# EasyEDA Pro project ProProject_平衡车主板-mpu6050正_2024-04-23.epro

# Schematic SCH原理图
Create Date: 2023-12-14; Page Name: P1; Project Name: 平衡车主板-mpu6050正; Schematic Name: SCH原理图; Update Date: 2023-12-15; Company: 蜗牛学院AIoT; Drawed: lzy; Page Size: A4; Version: V1.2
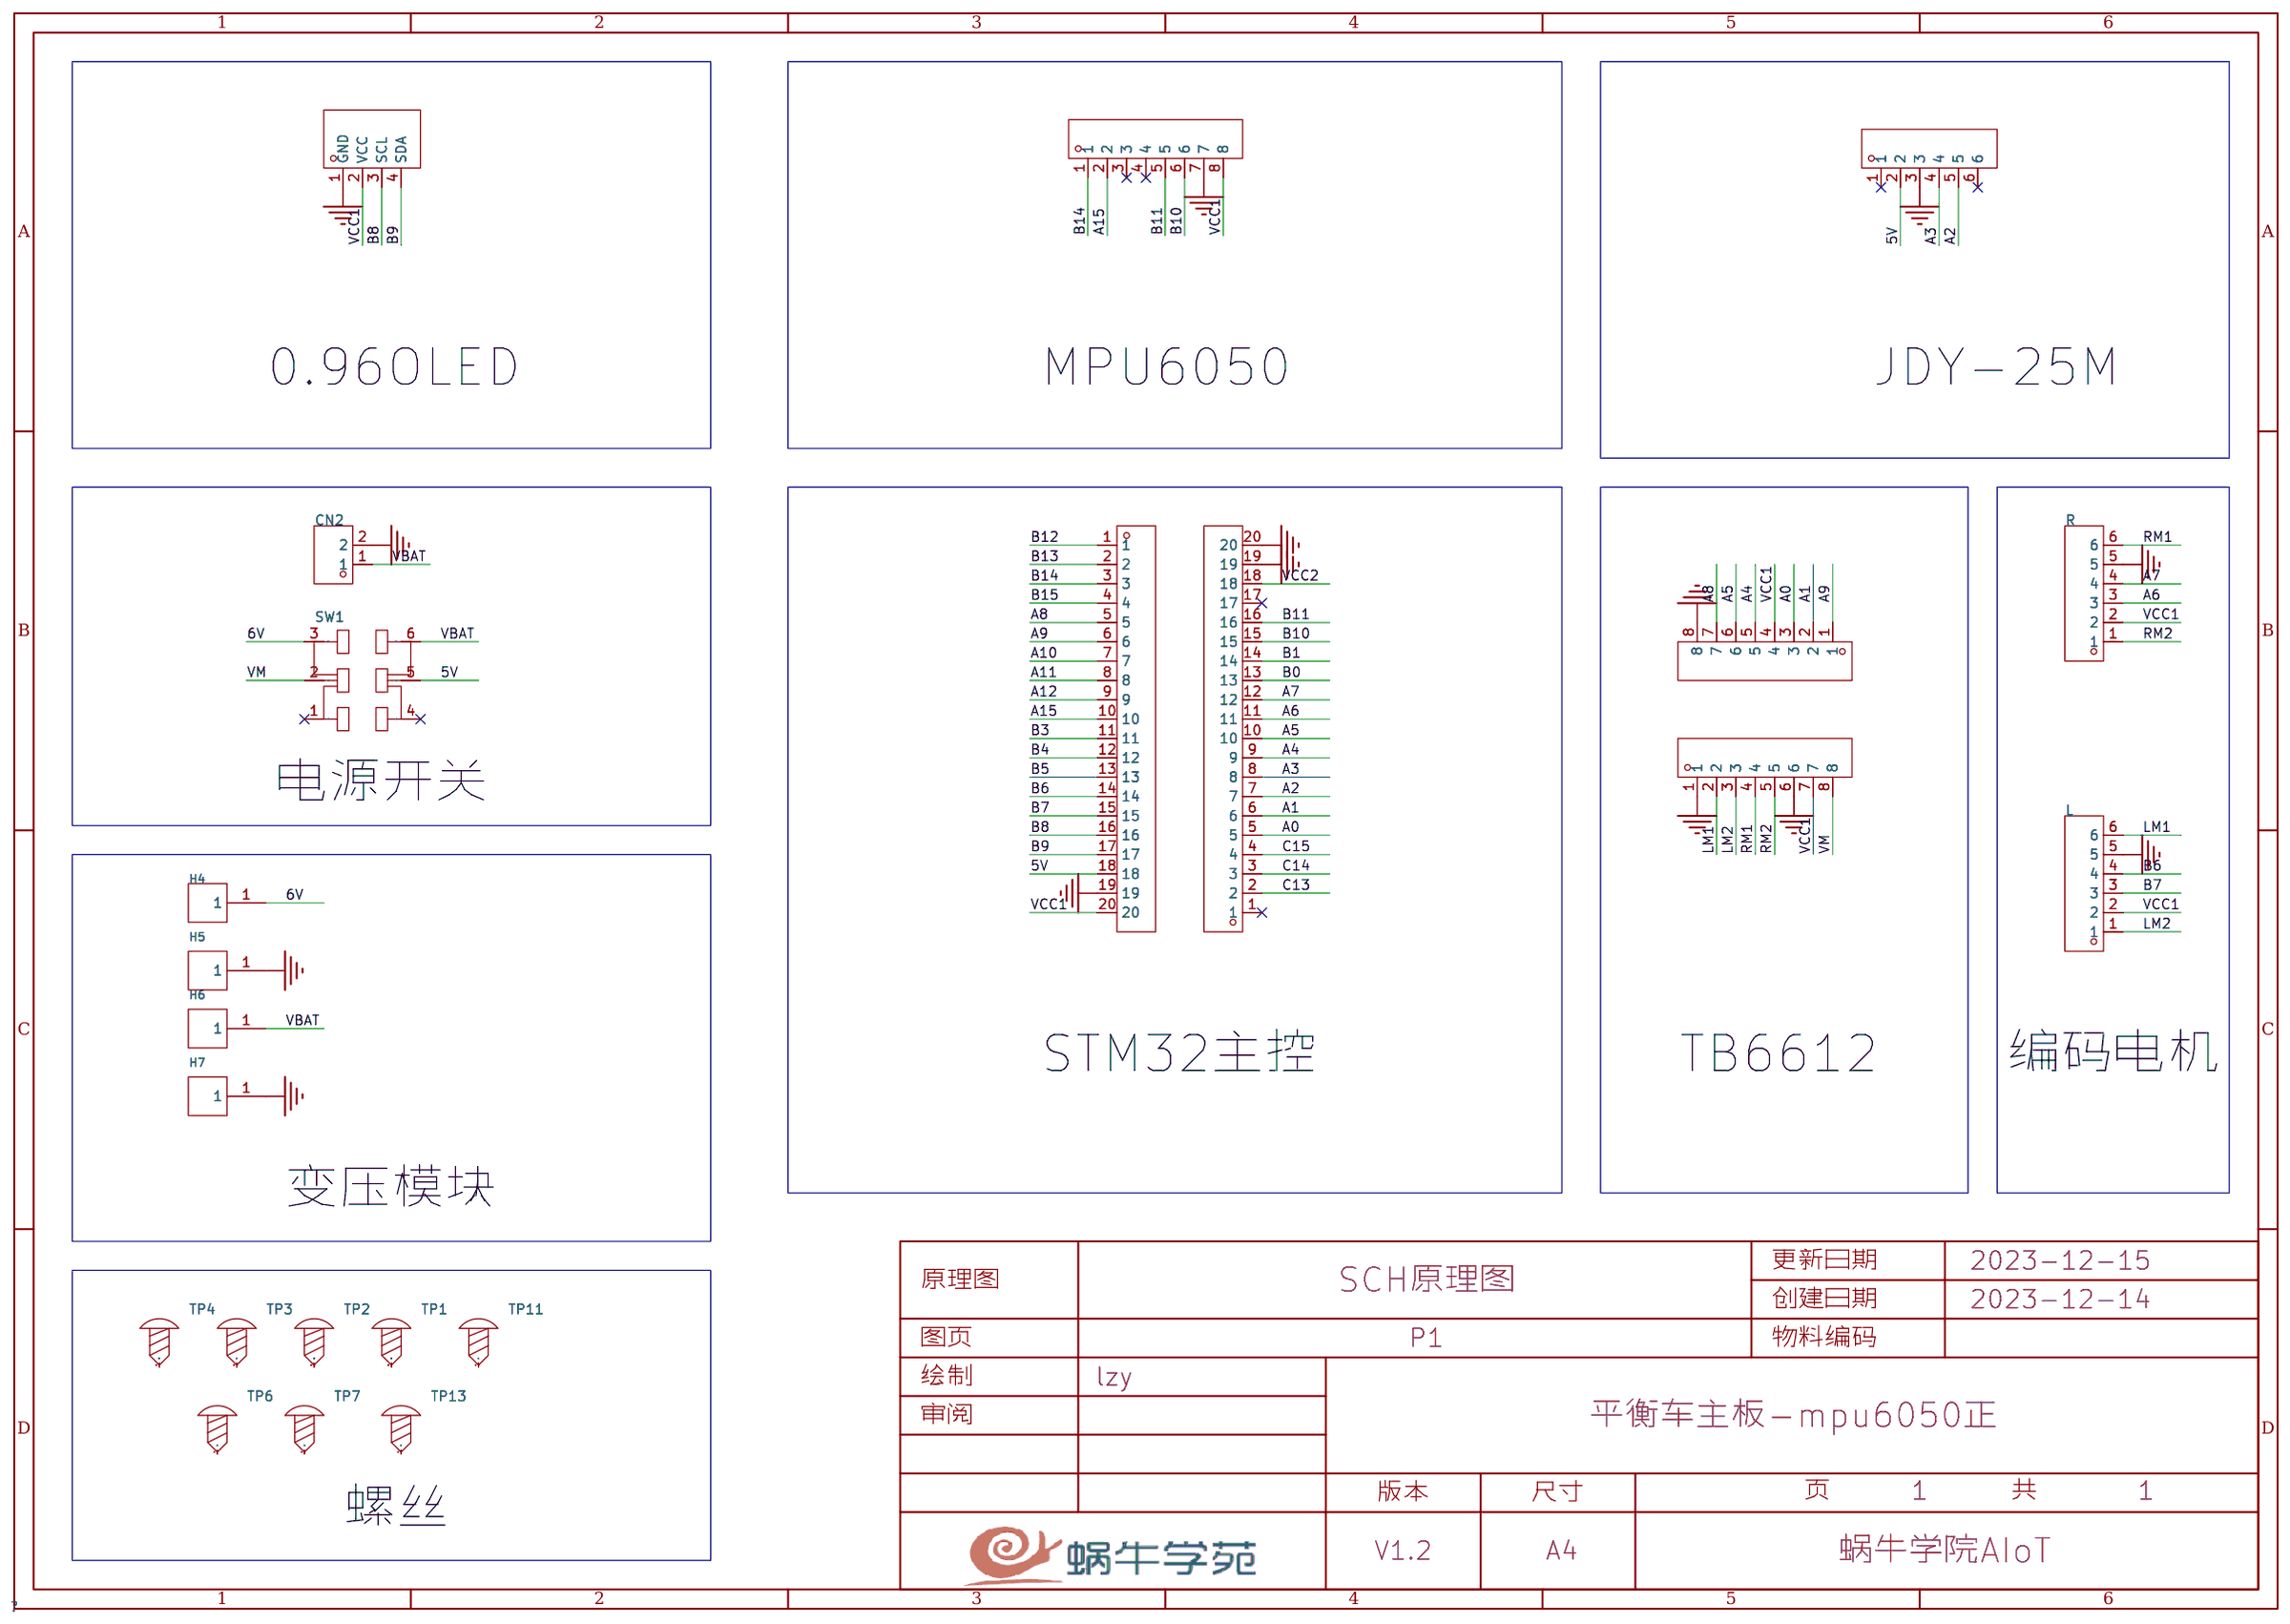
[diagram p0: schematic sheet]

## Parts
CN2  XH-2AW  [CONN-TH_XH-2AW_C2908611]
H1  PM254V-11-06-H85  [HDR-TH_6P-P2.54-V-F]
H4  PZ254V-11-01P  [HDR-TH_1P-P2.54-V-M]
H5  PZ254V-11-01P  [HDR-TH_1P-P2.54-V-M]
H6  PZ254V-11-01P  [HDR-TH_1P-P2.54-V-M]
H7  PZ254V-11-01P  [HDR-TH_1P-P2.54-V-M]
L  PM254V-11-06-H85  [HDR-TH_6P-P2.54-V-F]
OLED  HS96L03W2C03  [OLED-TH_L27.8-W27.2-P2.54_C9900033791]
R  PM254V-11-06-H85  [HDR-TH_6P-P2.54-V-F]
SW1  MSS22D18G2  [SW-TH_MSS22D18GX]
TP1  -  [M3螺丝]
TP2  -  [M3螺丝]
TP3  -  [M3螺丝]
TP4  -  [M3螺丝]
TP6  -  [M2螺丝]
TP7  -  [M2螺丝]
TP11  -  [M3螺丝]
TP13  -  [M2螺丝]
U1  PM254-1-20-Z-8.5  [HDR-TH_20P-P2.54-V-F-2]
U2  PM254-1-20-Z-8.5  [HDR-TH_20P-P2.54-V-F-2]
U4  PM254-1-08-Z-8.5  [HDR-TH_8P-P2.54-V-F]
U5  PM254-1-08-Z-8.5  [HDR-TH_8P-P2.54-V-F]
U6  PM254-1-08-Z-8.5  [HDR-TH_8P-P2.54-V-F]

## Library data of the parts
CN2 = XH-2AW_C2908611: 插针结构:1x2P;间距:2.54mm;公母:公;安装方式:弯插;行距:-;排数:1;每排PIN数:2;参考系列:XH;额定电流:3A;工作温度范围:-25℃~+85℃;; LCSC Part Name: 1x2P 间距:2.54mm 弯插 系列:XH; Supplier Part: C2908611; Manufacturer: HCTL(华灿天禄); Supplier Footprint: 弯插,P=2.54mm; JLCPCB Part Class: 扩展库; Datasheet: https://atta.szlcsc.com/upload/public/pdf/source/20230711/B565BAF3B11666EF6B81B3605408F2BD.pdf; Supplier: LCSC; Pins Structure: 1x2P; Pitch: 2.54mm; Gender: 公; Mounting Style: 弯插; Number of Rows: 1; Number of PINs Per Row: 2; Reference Series: XH; Current Rating (Max): 3A; Operating Temperature Range: -25℃~+85℃
H1 L R = PM254V-11-06-H85: 排数:单排;总孔位数:6P;间距:2.54mm;插孔结构:1x6P;行距:-;安装类型:直插;圆孔/方孔:方孔;额定电流:3A;额定电压:250V;插孔方向:顶部;塑高:-;工作温度范围:-40℃~+105℃;; LCSC Part Name: 间距:2.54mm 1x6P 直插; Supplier Part: C2832269; Manufacturer: XFCN(兴飞); Supplier Footprint: 插件,P=2.54mm; JLCPCB Part Class: 扩展库; Datasheet: https://atta.szlcsc.com/upload/public/pdf/source/20210514/C2832269_B3EC97736B37C2783BDCE3050AA57447.pdf; Supplier: LCSC; Number of Rows: 单排; Number of Holes: 6P; Pitch: 2.54mm; Holes Structure: 1x6P; Mounting Type: 直插; Circular Hole / Square Hole: 方孔; Current Rating (Max): 3A; Voltage Rating (Max): 250V; Holes Direction: 顶部; Operating Temperature Range: -40℃~+105℃
H4-H7 = PZ254V-11-01P: 排数:单排;总PIN位数:1P;间距:2.54mm;插针结构:1x1P;行距:-;安装类型:直插;圆针/方针:方针;额定电流:-;额定电压:-;配合针长度:6mm;塑高:2.5mm;端接针长度:3mm;触头材质:黄铜;触头镀层:-;工作温度范围:-40℃~+105℃;颜色:黑色;; LCSC Part Name: 2.54mm 1x1P 直插 方针; Supplier Part: C492400; Manufacturer: XFCN(兴飞); Supplier Footprint: 插件,P=2.54mm; JLCPCB Part Class: 扩展库; Datasheet: https://atta.szlcsc.com/upload/public/pdf/source/20200309/C492400_46876A5B545F5AE6B8D4A09C46E276E8.pdf; Supplier: LCSC; Number of Rows: 单排; Number of Pins: 1P; Pitch: 2.54mm; Pin Structure: 1x1P; Mounting Type: 直插; Circluar Pins/Square Pins: 方针; Length of Mating Pin: 6mm; Insulation Height: 2.5mm; Length of End Connection Pin: 3mm; Contact Material: 黄铜; Operating Temperature Range: -40℃~+105℃; Color: 黑色
OLED = HS96L03W2C03: 尺寸(inch)：0.96寸 0.96&apos; 像素分辨率：128x64 128*64主控芯片：SSD1315 接口类型：I2C 外形:27.3*27.8；IIC/3SPI/4SPI串口通讯,工作温度范围-40℃—+70℃。4PIN黑底白光。; LCSC Part Name: 0.96寸OLED显示屏窄白光IIC; Supplier Part: C5248080; Manufacturer: HS(汉昇); JLCPCB Part Class: 扩展库; Datasheet: https://atta.szlcsc.com/upload/public/pdf/source/20230627/763D01F79A90007632F098068C7C8AD9.pdf; Supplier: LCSC
SW1 = MSS22D18G2: 电路结构:双刀双掷;安装方式:立插;开关颜色:-;额定电流(DC):100mA;额定电压(DC):12V;额定电流(AC):-;额定电压(AC):-;机械寿命:1万次;; LCSC Part Name: 两档立式插件 6脚拨动 柄长2.0MM; Supplier Part: C431542; Manufacturer: SHOU HAN(首韩); Supplier Footprint: 插件-6P,3.5x9.1mm; JLCPCB Part Class: 扩展库; Datasheet: https://atta.szlcsc.com/upload/public/pdf/source/20190925/C431542_E050BEEB1B86229ABAC8A73C9D45E525.pdf; Supplier: LCSC; Circuit: 双刀双掷; Pin Style: SMD接片; Switch Length: 9.1mm; Switch Width: 3.5mm; Switch Height: 3.5mm; Mounting Style: 立插; Current Rating (DC): 100mA; Voltage Rating (DC): 12V; Mechanical Life: 1万次; Operating Temperature: -10℃~+50℃
TP1-TP4 TP11 = M3螺丝: Supplier Footprint: 插件
TP6 TP7 TP13 = M2螺丝: Supplier Footprint: 插件
U1 U2 = PM254-1-20-Z-8.5: 插孔结构:1x20P;间距:2.54mm;总孔位数:20P;安装类型:直插;排数:单排;行距:-;圆孔/方孔:方孔;额定电流:3A;额定电压:-;插孔方向:顶部;塑高:8.5mm;工作温度范围:-40℃~+105℃;; LCSC Part Name: 间距:2.54mm 1x20P 直插; Supplier Part: C2897383; Manufacturer: HCTL(华灿天禄); Supplier Footprint: 插件,P=2.54mm; JLCPCB Part Class: 扩展库; Datasheet: https://atta.szlcsc.com/upload/public/pdf/source/20230609/534BE42964C679BDE98E061007C4ABD6.pdf; Supplier: LCSC; Holes Structure: 1x20P; Pitch: 2.54mm; Number of Holes: 20P; Mounting Type: 直插; Number of Rows: 单排; Circular Hole / Square Hole: 方孔; Current Rating (Max): 3A; Holes Direction: 顶部; Insulation Height: 8.5mm; Operating Temperature Range: -40℃~+105℃
U4-U6 = PM254-1-08-Z-8.5: 排数:单排;总孔位数:8P;间距:2.54mm;插孔结构:1x8P;行距:-;安装类型:直插;圆孔/方孔:方孔;额定电流:3A;额定电压:-;插孔方向:顶部;塑高:8.5mm;工作温度范围:-40℃~+105℃;; LCSC Part Name: 间距:2.54mm 1x8P 直插; Supplier Part: C2897371; Manufacturer: HCTL(华灿天禄); Supplier Footprint: 插件,P=2.54mm; JLCPCB Part Class: 扩展库; Datasheet: https://atta.szlcsc.com/upload/public/pdf/source/20230609/534BE42964C679BDE98E061007C4ABD6.pdf; Supplier: LCSC; Number of Rows: 单排; Number of Holes: 8P; Pitch: 2.54mm; Holes Structure: 1x8P; Mounting Type: 直插; Circular Hole / Square Hole: 方孔; Current Rating (Max): 3A; Holes Direction: 顶部; Insulation Height: 8.5mm; Operating Temperature Range: -40℃~+105℃

## Nets
5V: H1.2 SW1.5 U1.18
6V: H4.1 SW1.3
GND: CN2.2 H1.3 H5.1 H7.1 L.5 OLED.1(GND) R.5 U1.19 U2.19 U2.20 U4.1 U4.6 U5.8 U6.7
VBAT: CN2.1 H6.1 SW1.6
VCC1: L.2 OLED.2(VCC) R.2 U1.20 U4.7 U5.4 U6.8
VCC2: U2.18
A0: U2.5 U5.3
A1: U2.6 U5.2
A2: H1.5 U2.7
A3: H1.4 U2.8
A4: U2.9 U5.5
A5: U2.10 U5.6
A6: R.3 U2.11
A7: R.4 U2.12
A8: U1.5 U5.7
A9: U1.6 U5.1
A10: U1.7
A11: U1.8
A12: U1.9
A15: U1.10 U6.2
B0: U2.13
B1: U2.14
B3: U1.11
B4: U1.12
B5: U1.13
B6: L.4 U1.14
B7: L.3 U1.15
B8: OLED.3(SCL) U1.16
B9: OLED.4(SDA) U1.17
B10: U2.15 U6.6
B11: U2.16 U6.5
B12: U1.1
B13: U1.2
B14: U1.3 U6.1
B15: U1.4
C13: U2.2
C14: U2.3
C15: U2.4
LM1: L.6 U4.2
LM2: L.1 U4.3
RM1: R.6 U4.4
RM2: R.1 U4.5
VM: SW1.2 U4.8

Not connected (* = marked no-connect by the designer): H1 1* 6*; SW1 1* 4*; TP1 1; TP2 1; TP3 1; TP4 1; TP6 1; TP7 1; TP11 1; TP13 1; U2 1* 17*; U6 3* 4*

## Notes on the sheet
- 0.96OLED
- MPU6050
- JDY-25M
- 电源开关
- STM32主控
- TB6612
- 编码电机
- 变压模块
- 螺丝

# Board PCB图
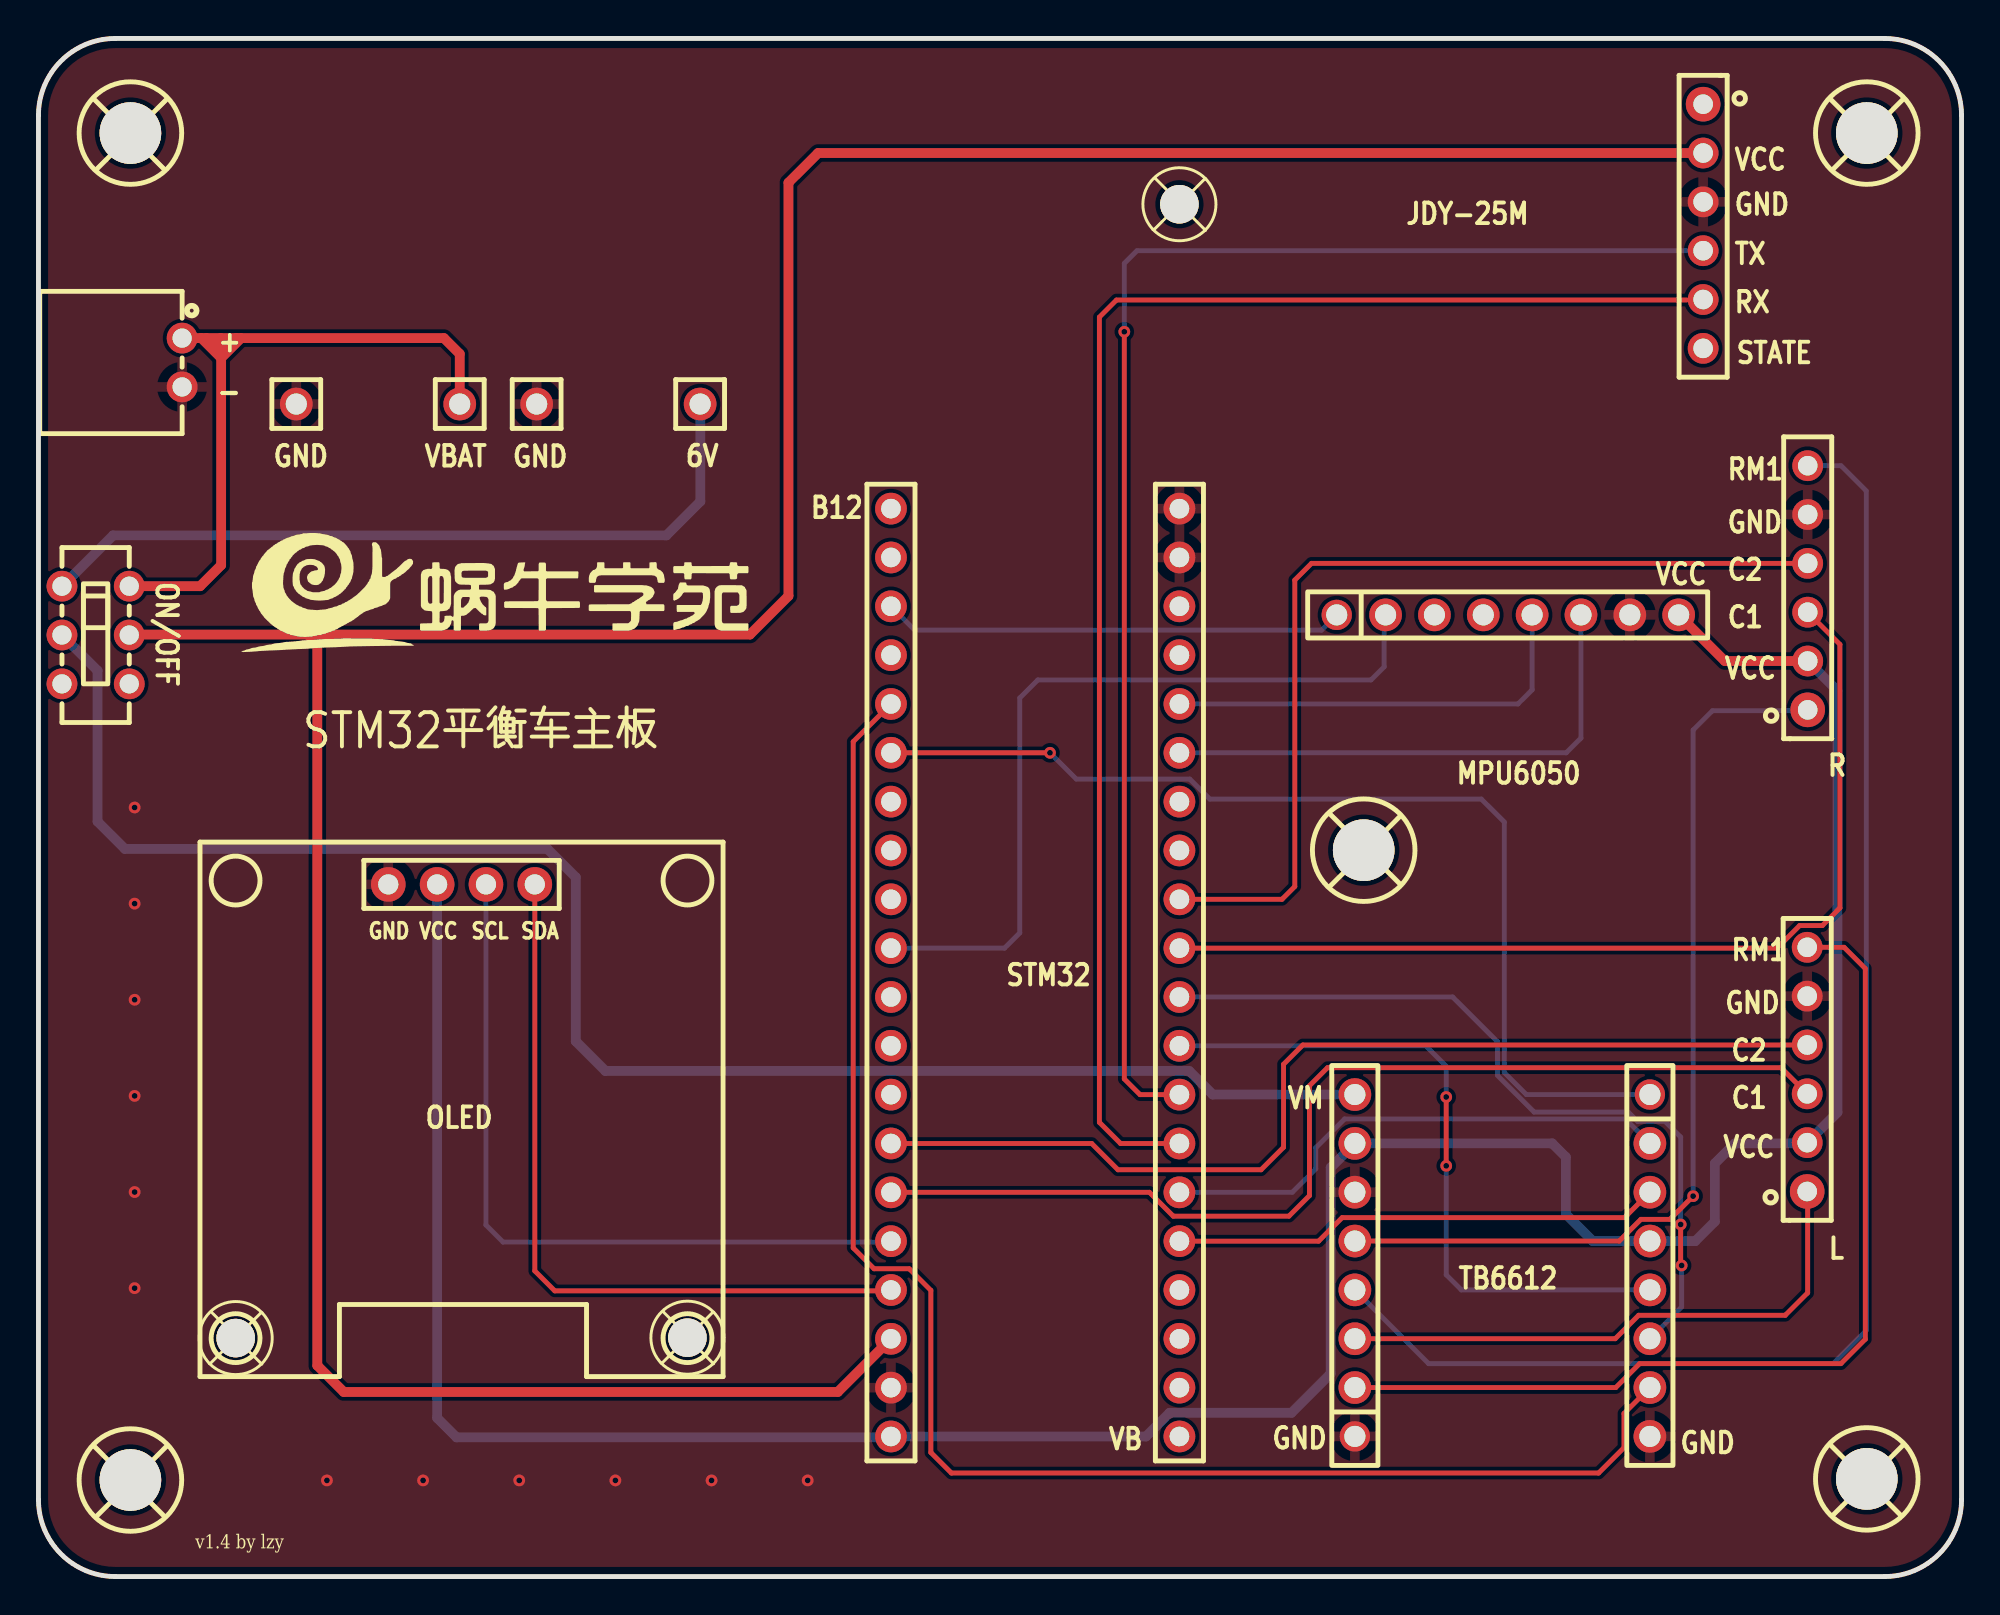
[diagram p1: board, top side]
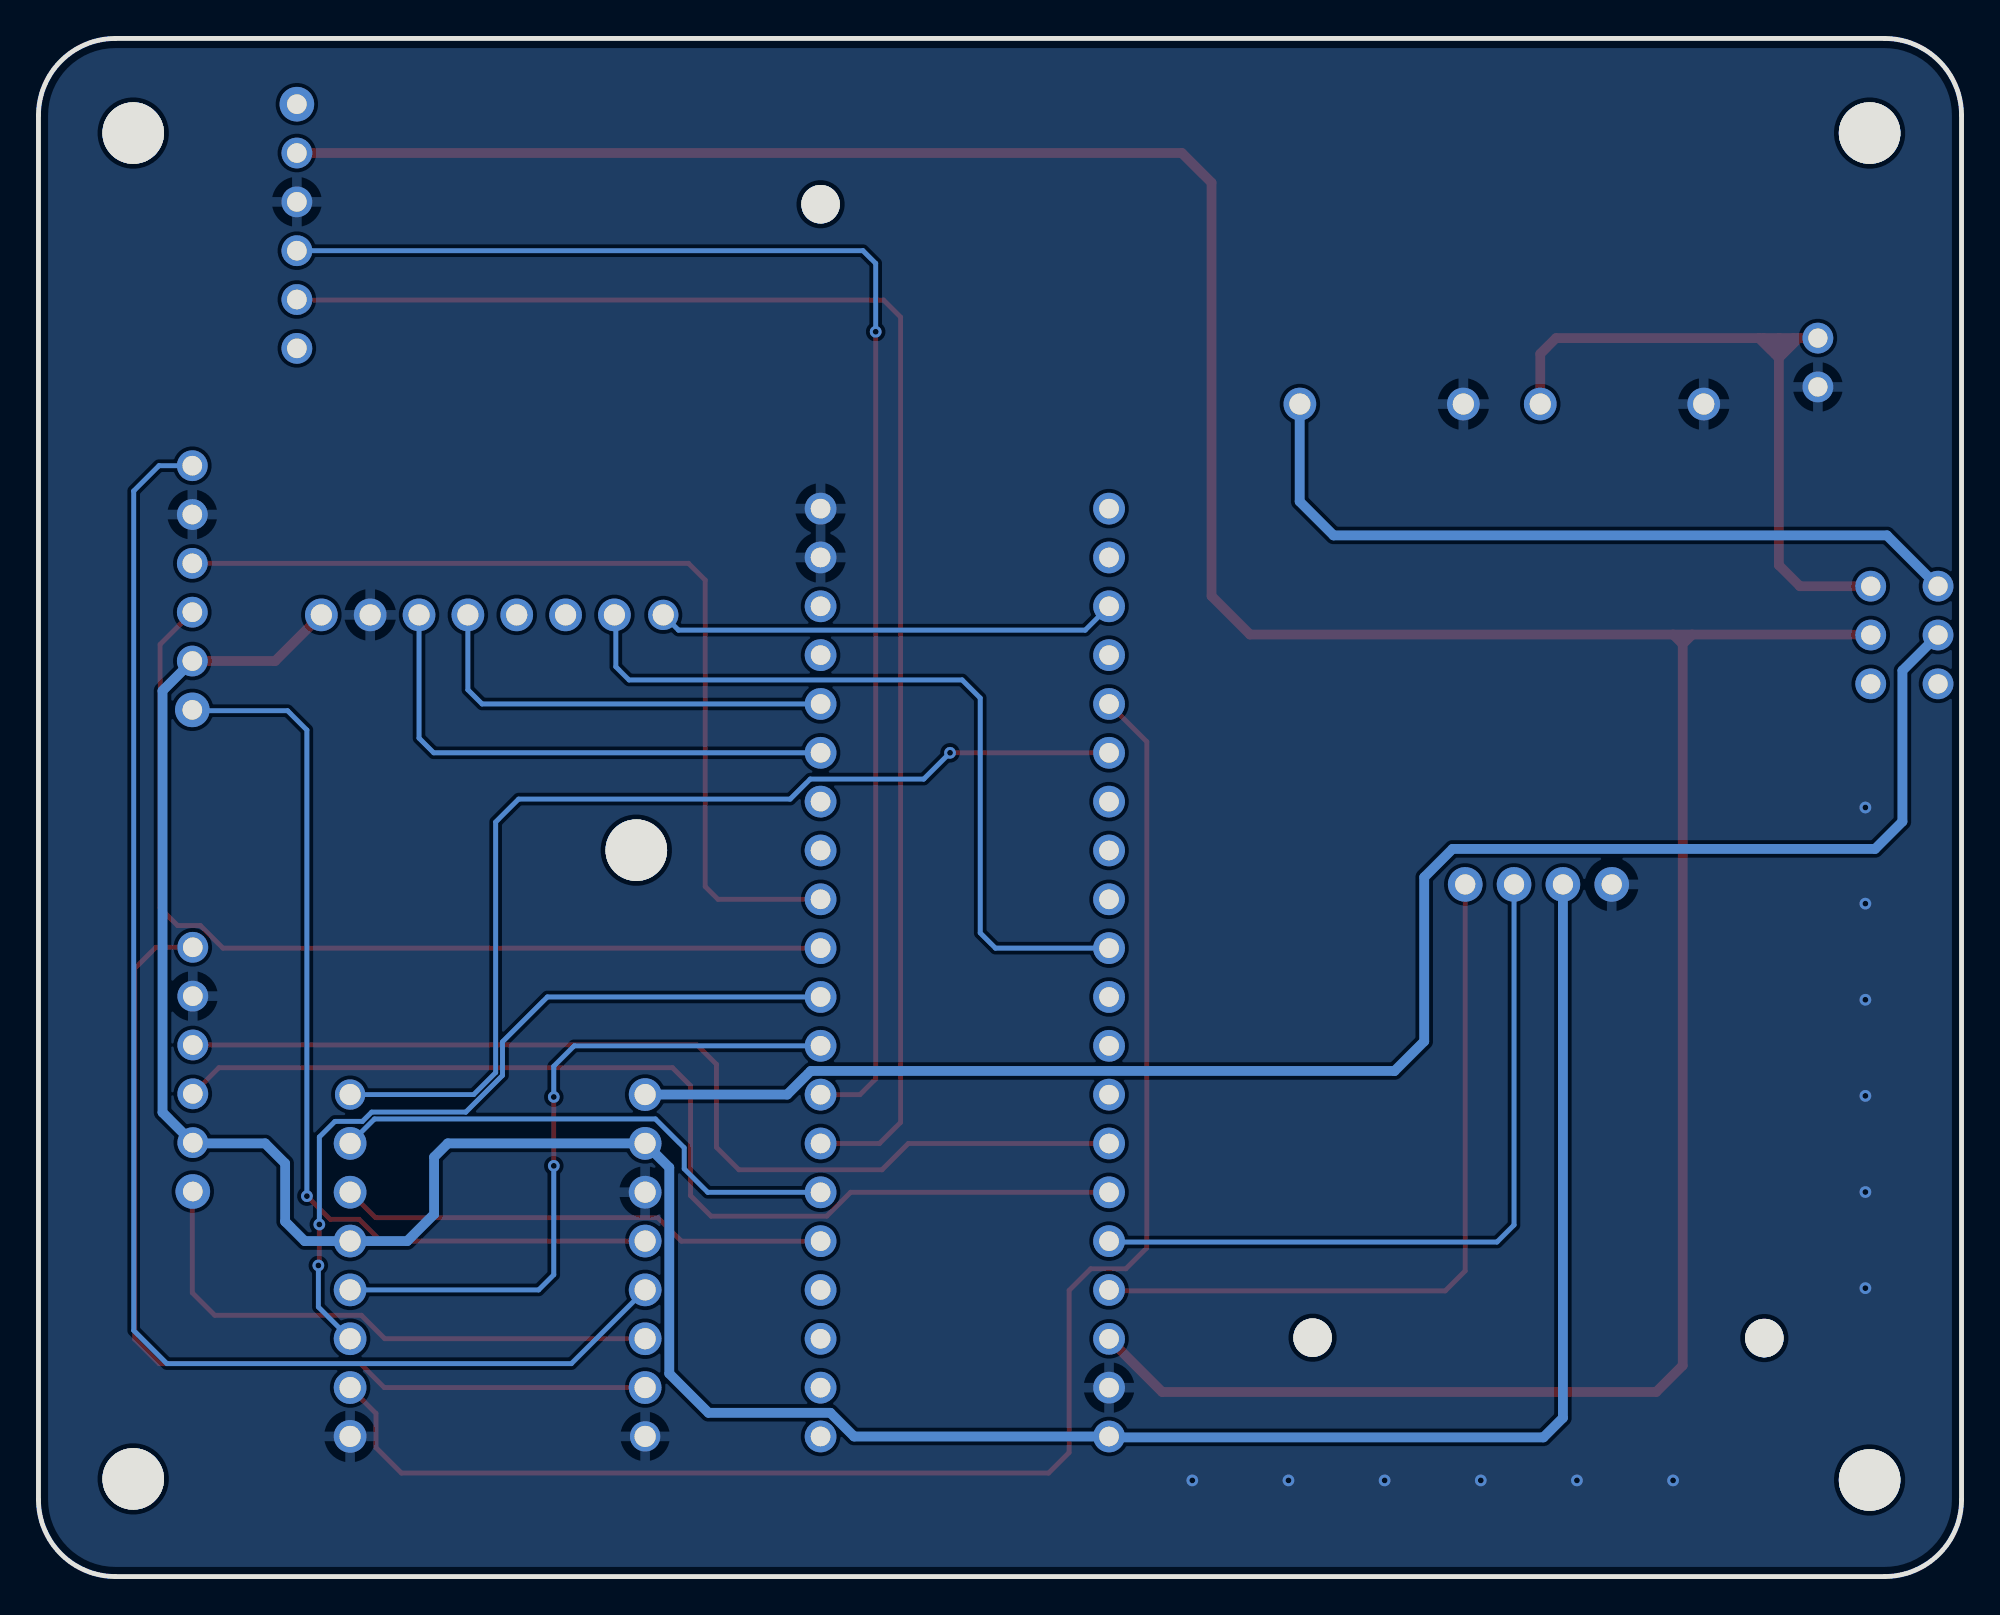
[diagram p2: board, bottom side, seen from below]

Outline 100 x 80 mm; copper layers: Top Layer, Bottom Layer. Coordinates in mm from the lower left corner of the outline.
Outline path: 0,76 0,4 arc(1.17,1.17) 4,0 96,0 arc(98.83,1.17) 100,4 100,76 arc(98.83,78.83) 96,80 4,80 arc(1.17,78.83) 0,76
Stack: Top Layer 0.035mm / Dielectric1 1.51mm FR4 er 4.5 / Bottom Layer 0.035mm

## Design rules (mm)
template: JLCPCB Capability(Two Layers Board)
spacing copperThickness1oz (default): track to track 0.102, other pairs 0.152 to 0.3
spacing copperThickness2oz: track to track 0.203, other pairs 0.152 to 0.3
track width copperThickness1oz (default): min 0.127, default 0.254, max 2.54
track width copperThickness2oz: min 0.203, default 0.254, max 2.54
differential pair differentialPair (default): width min 0.127, default 0.254, max 2.54; gap min 0.152, default 0.152
via viaSize (default): diameter min 0.5, default 0.61, max 10; hole min 0.3, default 0.305, max 6.3

## Placement (name value [footprint] x y rotation side)
CN2  XH-2AW  [CONN-TH_XH-2AW_C2908611]  7.47 63.14 270 top
H1  PM254V-11-06-H85  [hdr-th_6p-p2.54-v-f]  86.56 70.23 270 top
H4  PZ254V-11-01P  [hdr-th_1p-p2.54-v-m]  34.41 60.98 270 top
H5  PZ254V-11-01P  [hdr-th_1p-p2.54-v-m]  25.91 60.98 270 top
H6  PZ254V-11-01P  [hdr-th_1p-p2.54-v-m]  21.91 60.98 270 top
H7  PZ254V-11-01P  [hdr-th_1p-p2.54-v-m]  13.41 60.98 270 top
L  PM254V-11-06-H85  [hdr-th_6p-p2.54-v-f]  91.97 26.38 90 top
OLED  HS96L03W2C03  [OLED-TH_L27.8-W27.2-P2.54_C9900033791]  22 36 0 top
R  PM254V-11-06-H85  [hdr-th_6p-p2.54-v-f]  92 51.43 90 top
SW1  MSS22D18G2  [SW-TH_MSS22D18GX]  2.97 48.97 90 top
TP1  -  [M3螺丝]  4.84 4.96 0 top
TP2  -  [M3螺丝]  4.84 75.02 0 top
TP3  -  [M3螺丝]  95.14 75.02 0 top
TP4  -  [M3螺丝]  95.14 5.02 0 top
TP6  -  [M2螺丝]  10.26 12.4 0 top
TP7  -  [M2螺丝]  33.75 12.42 0 top
TP11  -  [M3螺丝]  68.98 37.84 90 top
TP13  -  [M2螺丝]  59.33 71.38 0 top
U1  PM254-1-20-Z-8.5  [hdr-th_20p-p2.54-v-f-2]  44.33 31.42 270 top
U2  PM254-1-20-Z-8.5  [hdr-th_20p-p2.54-v-f-2]  59.33 31.42 90 top
U4  PM254-1-08-Z-8.5  [hdr-th_8p-p2.54-v-f]  68.45 16.18 90 top
U5  PM254-1-08-Z-8.5  [hdr-th_8p-p2.54-v-f]  83.79 16.18 270 top
U6  PM254-1-08-Z-8.5  [hdr-th_8p-p2.54-v-f]  76.4 50.02 0 top

## Footprints (pads in the part's own frame, mm; a bottom-side part is the same pattern mirrored in y, then rotated)
CONN-TH_XH-2AW_C2908611
  round 1.6 hole 1: 1(-1.27,0) 2(1.27,0)
hdr-th_1p-p2.54-v-m
  round 1.7 hole 1.1: 1(0,0)
hdr-th_6p-p2.54-v-f
  round 1.8 hole 1.02: 1(-6.35,0)
  round 1.6 hole 1.02: 2(-3.81,0) 3(-1.27,0) 4(1.27,0) 5(3.81,0) 6(6.35,0)
hdr-th_8p-p2.54-v-f
  round 1.575 hole 1.1: 1(-8.89,0)
  round 1.7 hole 1.1: 2(-6.35,0) 3(-3.81,0) 4(-1.27,0) 5(1.27,0) 6(3.81,0) 7(6.35,0) 8(8.89,0)
hdr-th_20p-p2.54-v-f-2
  round 1.65 hole 1.02: 1(-24.13,0) 2(-21.59,0) 3(-19.05,0) 4(-16.51,0) 5(-13.97,0) 6(-11.43,0) 7(-8.89,0) 8(-6.35,0) 9(-3.81,0) 10(-1.27,0) 11(1.27,0) 12(3.81,0) 13(6.35,0) 14(8.89,0) 15(11.43,0) 16(13.97,0) 17(16.51,0) 18(19.05,0) 19(21.59,0) 20(24.13,0)
M2螺丝
  round 2 hole 2: 1(0,0)
M3螺丝
  round 3.2 hole 3.2: 1(-0.064,0.064)
OLED-TH_L27.8-W27.2-P2.54_C9900033791
  round 1.8 hole 1.05: 1(-3.81,0) 2(-1.27,0) 3(1.27,0) 4(3.81,0)
SW-TH_MSS22D18GX
  round 1.6 hole 1: 1(-2.54,1.75) 2(0,1.75) 3(2.54,1.75) 4(-2.54,-1.75) 5(0,-1.75) 6(2.54,-1.75)

## Nets
As in the schematic.

Pads without a net: H1 1 6; SW1 1 4; TP1 1; TP2 1; TP3 1; TP4 1; TP6 1; TP7 1; TP11 1; TP13 1; U2 1 17; U6 3 4

## Via types
v1: diameter 0.61, hole 0.305, Top Layer to Bottom Layer, 19 vias

## Routing (per net, layer and track width the routed paths; a pad name or vN(x,y) marks a point on that pad's centre or on a via; arc(x,y) is an arc through that point)
5V: length 175.3
  Top Layer w0.508: 15,49 37,49 39,51 39,72.5 40.54,74.04 H1.2 ; 15,49 14,49 ; 15,49 14.5,48.5 ; 14,49 4.75,49 SW1.5 ; 14,49 14.5,48.5 ; U1.18 41.57,9.6 15.88,9.6 14.5,10.98 14.5,48.5
6V: length 39.6
  Bottom Layer w0.508: 34.42,60.5 34.42,55.92 32.65,54.15 3.88,54.15 1.26,51.54
GND:
  vias: v1(5,40) v1(5,35) v1(5,30) v1(5,25) v1(5,20) v1(5,15) v1(15,5) v1(20,5) v1(25,5) v1(30,5) v1(35,5) v1(40,5)
VBAT: length 39.6
  Top Layer w0.508: 9.5,63.38 10.53,64.41 ; 9.5,63.38 9.5,63.65 ; 9.5,63.38 8.47,64.41 ; 9.5,63.38 9.5,52.61 8.41,51.51 SW1.6 ; 10.53,64.41 21.09,64.41 21.91,63.59 H6.1 ; 10.53,64.41 10.29,64.41 ; 8.47,64.41 8.73,64.41 ; 8.47,64.41 CN2.1 ; 8.73,64.41 9.5,63.65 ; 8.73,64.41 9.48,64.41 ; 9.5,63.65 9.5,64.39 9.48,64.41 ; 9.5,63.65 9.5,63.62 10.29,64.41 ; 9.48,64.41 10.29,64.41
VCC1: length 153.8
  Top Layer w0.508: R.2 87.69,47.62 U6.8
  Bottom Layer w0.508: OLED.2 20.73,8.25 21.74,7.24 44.28,7.24 U1.20 57.59,7.28 58.82,8.52 65.16,8.52 67.2,10.56 67.2,21.27 U4.7 78.71,22.53 79.43,21.82 79.43,18.85 80.82,17.45 U5.4 86.16,17.45 87.17,18.47 87.17,21.49 88.21,22.53 91.94,22.53 L.2 93.55,24.14 93.55,46.07 R.2
A0: length 25.5
  Top Layer w0.254: U5.3 82.47,18.67 67.79,18.67 66.57,17.44 U2.5
A1: length 27.2
  Bottom Layer w0.254: U5.2 82.52,23.8 67.92,23.8 66.42,22.3 66.42,21.21 65.2,19.99 U2.6
A2: length 77.4
  Top Layer w0.254: 85.7,66.4 56.06,66.4 55.17,65.51 55.17,23.62 56.27,22.53 U2.7
A3: length 76
  Top Layer w0.254: v1(56.46,64.74) 56.46,25.88 57.28,25.06 59.33,25.06
  Bottom Layer w0.254: H1.4 57.12,68.96 56.46,68.3 v1(56.46,64.74)
A4: length 36.2
  Top Layer w0.254: 73.18,21.34 v1(73.2,21.36) v1(73.2,24.94)
  Bottom Layer w0.254: v1(73.2,21.36) 73.2,15.7 73.99,14.91 U5.5 ; 73.15,24.89 v1(73.2,24.94) 73.2,26.54 72.14,27.61 U2.9
A5: length 41.3
  Top Layer w0.254: v1(85.4,18.31) 85.4,16.23 v1(85.45,16.18)
  Bottom Layer w0.254: 59.33,30.14 73.54,30.14 75.87,27.81 75.87,26.07 77.78,24.16 82.67,24.16 83.16,23.67 84.58,23.67 85.4,22.86 v1(85.4,18.31) ; v1(85.45,16.18) 85.45,14.02 U5.6
A6: length 51.3
  Top Layer w0.254: U2.11 90.41,32.69 91.58,33.86 92.76,33.86 93.68,34.77 93.68,48.48 R.3
A7: length 49.4
  Top Layer w0.254: R.4 91.83,52.53 91.66,52.7 66.2,52.7 65.33,51.83 65.33,35.89 64.66,35.22 59.33,35.22
A8: length 83.2
  Top Layer w0.254: U1.5 42.37,43.42 42.37,17.09 43.45,16.01 45.28,16.01 46.41,14.88 46.41,6.45 47.47,5.38 81.13,5.38 82.45,6.71 82.45,8.48 U5.7
A9: length 54.5
  Top Layer w0.254: U1.6 v1(52.6,42.84)
  Bottom Layer w0.254: v1(52.6,42.84) 53.97,41.48 59.87,41.48 60.91,40.44 75.03,40.44 76.23,39.24 76.23,26.21 77.37,25.07 U5.1
A15: length 41.1
  Bottom Layer w0.254: 69.96,49.52 69.98,49.5 69.98,47.32 69.29,46.63 51.97,46.63 51.03,45.69 51.03,33.48 50.24,32.69 U1.10
B6: length 53.4
  Top Layer w0.254: L.4 65.75,27.65 64.74,26.64 64.74,22.33 63.58,21.16 56.13,21.16 54.77,22.53 U1.14
B7: length 55.3
  Top Layer w0.254: U1.15 57.77,19.99 59.01,18.75 65.02,18.75 66.09,19.81 66.09,25.53 67.03,26.47 90.62,26.47 L.3
B8: length 39.2
  Bottom Layer w0.254: U1.16 44.28,17.4 24.16,17.4 23.27,18.28 OLED.3
B9: length 39.1
  Top Layer w0.254: U1.17 44.28,14.86 26.85,14.86 25.81,15.9 OLED.4
B10: length 27.6
  Bottom Layer w0.254: U2.15 79.45,42.84 80.21,43.61 U6.6
B11: length 22.5
  Bottom Layer w0.254: U2.16 76.93,45.39 77.67,46.12 U6.5
B14: length 24
  Bottom Layer w0.254: U6.1 66.72,49.22 45.57,49.22 U1.3
LM1: length 50.3
  Top Layer w0.254: L.6 93.89,32.73 95,31.62 95,12.34 93.73,11.07 83.26,11.07 82.02,9.83 U4.2
LM2: length 29.8
  Top Layer w0.254: L.1 92,20 92,14.76 90.83,13.59 83.21,13.59 81.99,12.37 U4.3
RM1: length 76.2
  Bottom Layer w0.254: U4.4 72.29,11.07 93.32,11.07 95.05,12.8 95.05,56.46 93.73,57.78 R.6
RM2: length 49.3
  Top Layer w0.254: 86.16,19.79 v1(86.04,19.79) 84.83,18.58 83.33,18.58 82.2,17.45 U4.5
  Bottom Layer w0.254: v1(86.04,19.79) 86.04,44.03 87.05,45.03 91.96,45.03 R.1
VM: length 86.7
  Bottom Layer w0.508: U4.8 61.07,25.07 59.84,26.3 29.48,26.3 27.94,27.84 27.94,36.37 26.47,37.85 4.5,37.85 3.07,39.27 3.07,47.12 SW1.2

## Copper pours and planes (outline as drawn; the poured copper is in the pictures)
GND on Top Layer: -23.9,87.73 109.6,87.73 109.6,-9.27 -23.9,-9.27
GND on Bottom Layer: -10,99.5 108,99.5 108,-24.5 -10,-24.5

## Text on the board
Top Silkscreen Layer: GND | VCC | SCL | SDA | ON/OFF | + | VBAT | OLED | 6V | B12 | STM32 | VB | VM | JDY-25M | MPU6050 | TB6612 | RM1 | C2 | C1 | TX | RX | STATE | R | L | - | v1.4 by lzy | STM32平衡车主板
